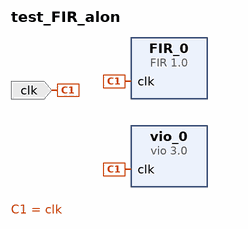
[diagram p0: block diagram of the top level]
# Vivado block design test_FIR_alon, xc7a35tcpg236-1, Vivado 2019.1
create_bd_design test_FIR_alon

create_bd_port -dir I -type clk clk
set_property -dict {CONFIG.FREQ_HZ 100000000} [get_bd_ports clk]

create_bd_cell -type ip -vlnv xilinx.com:user:FIR:1.0 FIR_0
set_property -dict {CONFIG.coef_width 2 CONFIG.log2_nbr_coef 1 CONFIG.nbr_coef 2 CONFIG.sig_width 4} [get_bd_cells FIR_0]
create_bd_cell -type ip -vlnv xilinx.com:ip:vio:3.0 vio_0

# ---- connections ----

connect_bd_net [get_bd_ports clk] [get_bd_pins vio_0/clk] [get_bd_pins FIR_0/clk]

validate_bd_design
save_bd_design
